# EAGLE design NavSwitch-Breakout (EAGLE 6.4)
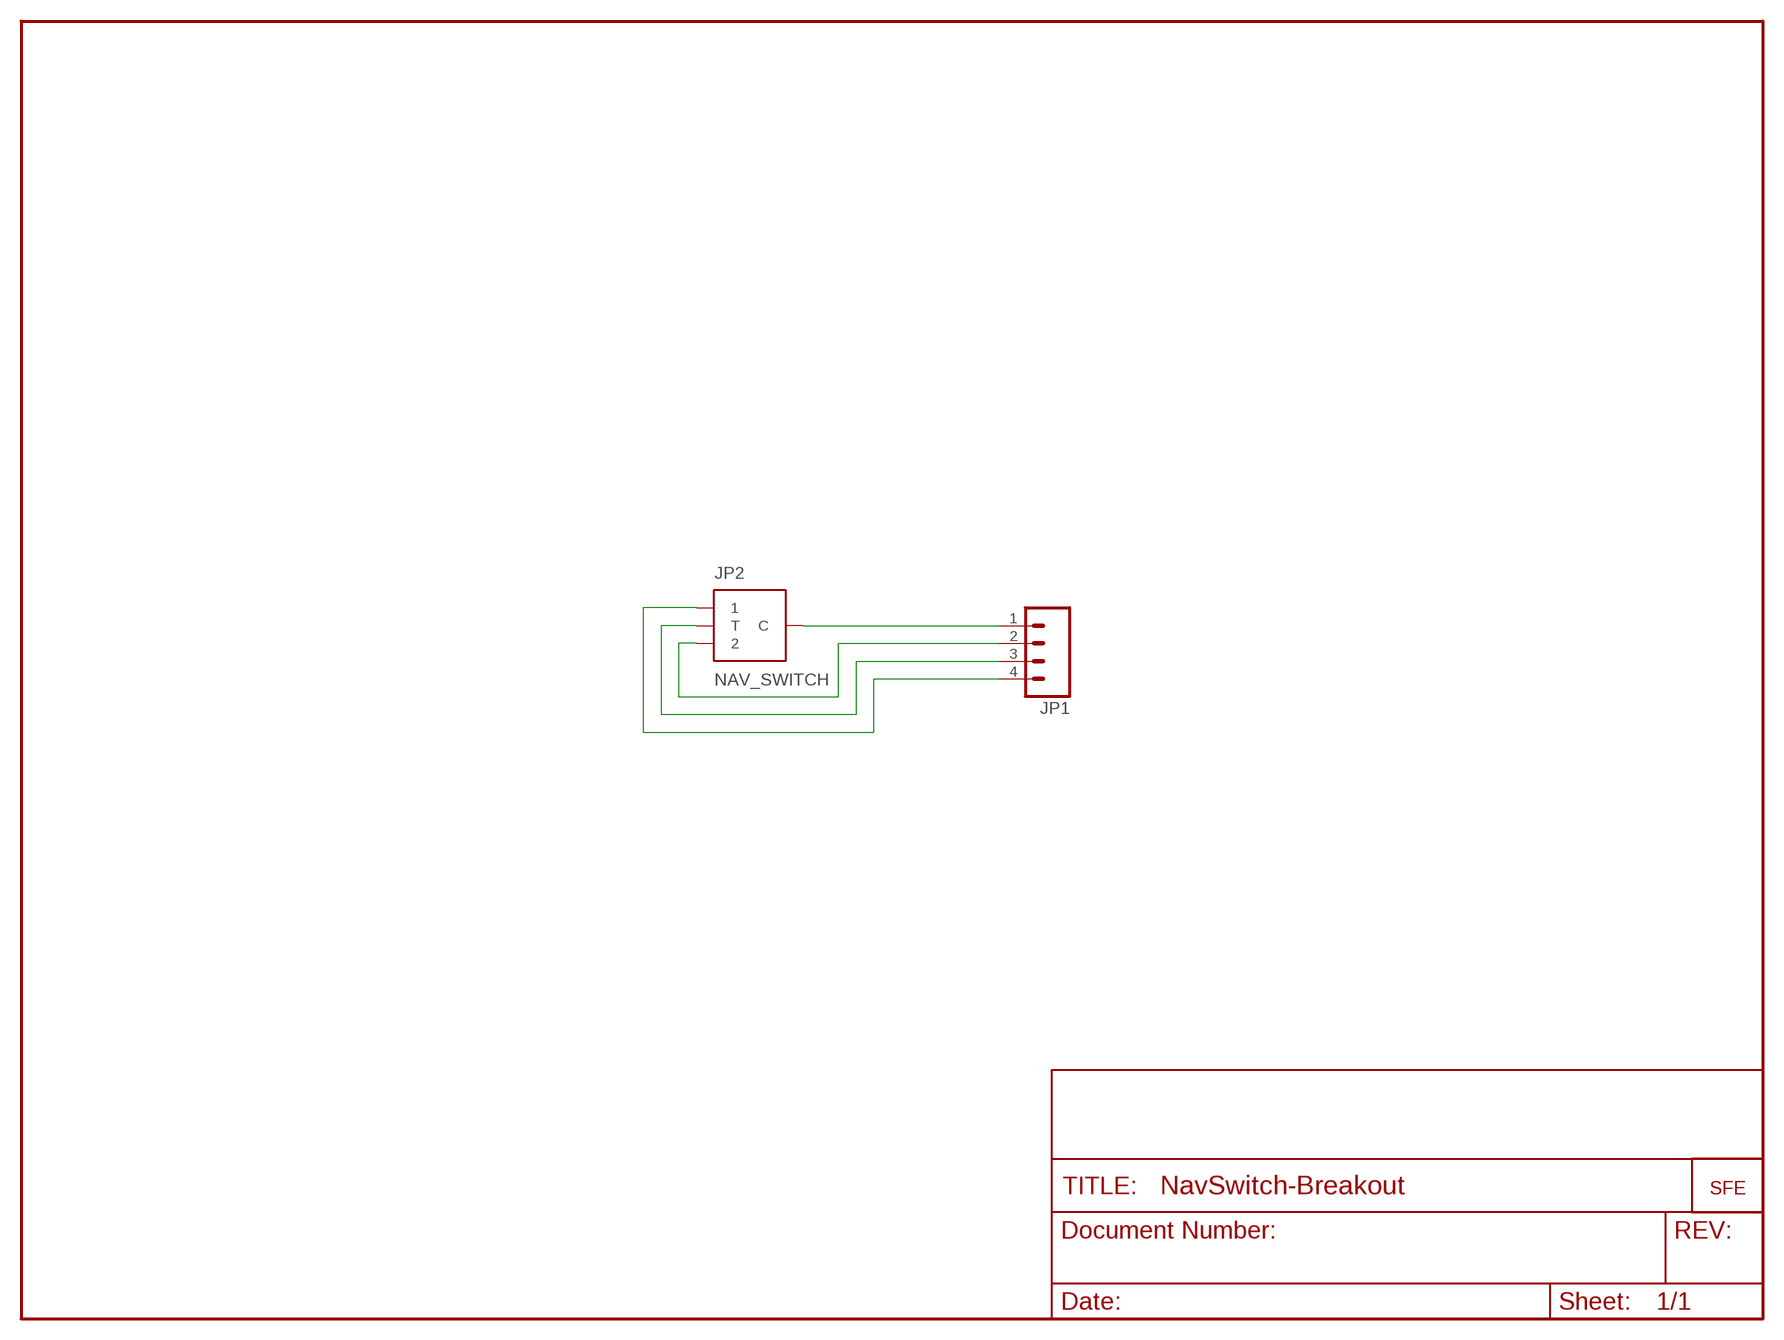
[diagram p0: schematic, sheet 1]

## Parts
JP1  M04PTH  [1X04]
JP2  NAV_SWITCH  NAV_SWITCHSMD  [NAV_SWITCH]
U$1  LOGO-SFESK  [SFE-LOGO-FLAME]

## Nets
N$1: JP1.1 JP2.C
N$2: JP1.2 JP2.2
N$3: JP1.3 JP2.T
N$4: JP1.4 JP2.1

## Library data of the parts
JP1 = SparkFun:M04: Header 4 Standard 4-pin 0.1" header. Use with straight break away headers (SKU : PRT-00116), right angle break away headers (PRT-00553), swiss pins (PRT-00743), machine pins (PRT-00117), and female headers (PRT-00115). Molex polarized connector foot print use with SKU : PRT-08231 with associated crimp pins and housings.
JP2 = SparkFun:NAV_SWITCH: Navigation Switch Three way navigation switch. Commonly used as up/down/select on MP3 players. Schematic element and footprint production proven. Spark Fun Electronics SKU : COM-08184
U$1 = SparkFun:LOGO-SFE: Spark Fun Electronics PCB Logo This is the standard Spark Fun Electronics PCB logo.

## Board
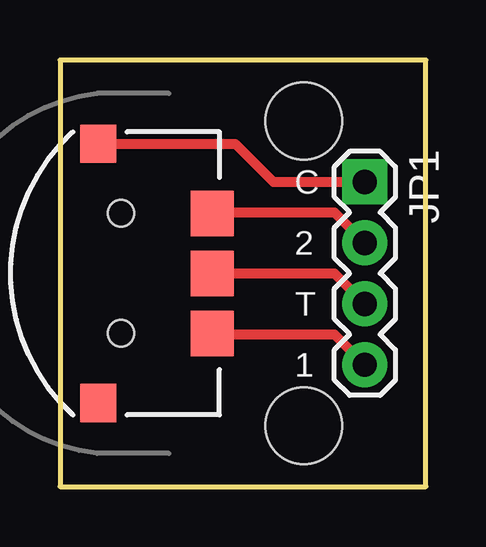
[diagram p1: board, top side]
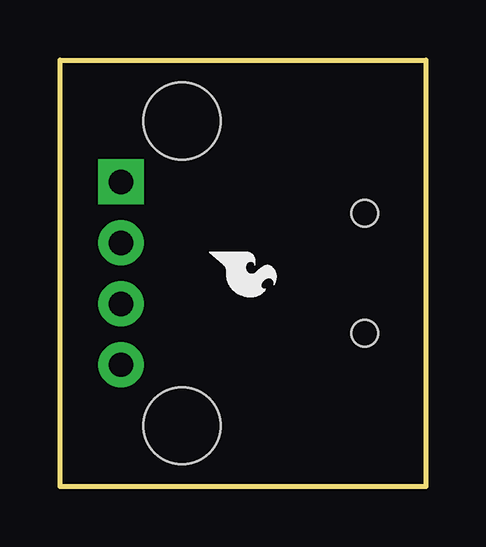
[diagram p2: board, bottom side, seen from below]

Size 15.24 x 17.78 mm. Coordinates in mm from the lower left corner, seen from the top.
Outline: 0,0 15.24,0 15.24,17.78 0,17.78 0,0
Copper layers (1*16): Top 0.035mm / dielectric 1.5mm / Bottom 0.035mm
Design rules "SparkFun": minimum track width 8mil, minimum drill 20mil, track to track 8mil, track to pad 8mil, pad to pad 8mil, via to via 8mil, smd to smd 8mil, copper to edge 10mil, drill to drill 8mil, minimum pad ring 12mil, minimum via ring 10mil, stop-mask expansion 4mil, vias tented up to drill 20mil, thermal gap 10mil
Holes 3.2 mm at 10.16,15.24 10.16,2.54

### Footprints (pad centres in the part's own frame; a part is rotated, then mirrored left to right if it is on the bottom)
1X04 = drill 1.016 pad 1.88 square: 1 0,0 | drill 1.016 pad 1.88: 2 2.54,0; 3 5.08,0; 4 7.62,0
NAV_SWITCH = smd 1.9 x 1.8: 1 -2.5,-3.8; 2 2.5,-3.8; T 0,-3.8 | smd 1.6 x 1.5: C 5.4,0.95; NC -5.4,0.95 | hole 1.1: -2.5,0; 2.5,0

### Placement (x,y rotation side)
JP1  12.7,12.7 270 top
JP2  2.54,8.89 90 top
U$1  9.02,9.78 270 bottom

### Tracks (layer width: path | path; a pad name or v marks a point on that pad's centre or on a via)
N$1
  Top 0.406: JP2.C 7.3,14.29 8.89,12.7 JP1.1
N$2
  Top 0.406: JP2.2 6.35,11.43 11.43,11.43 JP1.2
N$3
  Top 0.406: JP1.3 11.43,8.89 JP2.T
N$4
  Top 0.406: JP2.1 6.35,6.35 11.43,6.35 JP1.4

### Text on the board
tPlace: C | 2 | T | 1